# EAGLE design ow_switch2 (EAGLE 6.5.0)
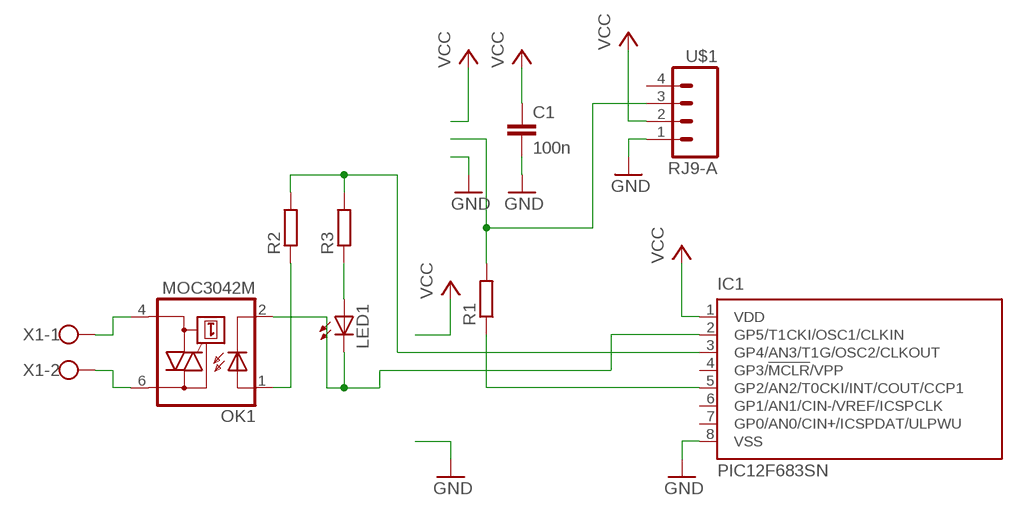
[diagram p0: schematic, sheet 1]

## Parts
C1  100n  C-EUC1206  [C1206]
IC1  PIC12F683SN  [SO-08]
LED1  LEDSMT1206  [1206]
OK1  MOC3042M  [DIL06]
R1  R-EU_R1206  [R1206]
R2  R-EU_R1206  [R1206]
R3  R-EU_R1206  [R1206]
U$1  RJ9-A  [RJ9-A]
X1  W237-102  [W237-102]

## Nets
GND: C1.2 IC1.8(VSS) U$1.1
N$1: LED1.A R3.1
N$2: IC1.5(GP2/AN2/T0CKI/INT/COUT/CCP1) R1.1
N$3: R1.2 U$1.3
N$4: IC1.3(GP4/AN3/T1G/OSC2/CLKOUT) R2.2 R3.2
N$5: OK1.1(A) R2.1
N$8: OK1.6(A2) X1.2
N$9: OK1.4(A1) X1.1
N$11: IC1.2(GP5/T1CKI/OSC1/CLKIN) LED1.C OK1.2(C)
VCC: C1.1 IC1.1(VDD) U$1.2
Unconnected: IC1.4(GP3/!MCLR!/VPP) IC1.6(GP1/AN1/CIN-/VREF/ICSPCLK) IC1.7(GP0/AN0/CIN+/ICSPDAT/ULPWU) U$1.4

## Library data of the parts
C1 = rcl:C-EU: CAPACITOR, European symbol
IC1 = microchip:PIC12F683: 8-Pin Flash-Based, 8-Bit CMOS Microcontrollers with nanoWatt Technology Source: http://ww1.microchip.com/downloads/en/DeviceDoc/41211D_.pdf; MF: MICROCHIP; MPN: PIC12F683-I/SN; OC_FARNELL: 9759042; OC_NEWARK: 61K3434
LED1 = led:LED: LED OSRAM: - CHIPLED LG R971, LG N971, LY N971, LG Q971, LY Q971, LO R971, LY R971 LH N974, LH R974 LS Q976, LO Q976, LY Q976 LO Q996 - Hyper CHIPLED LW Q18S LB Q993, LB Q99A, LB R99A - SideLED LS A670, LO A670, LY A670, LG A670, LP A670 LB A673, LV A673, LT A673, LW A673 LH A674 LY A675 LS A676, LA A676, LO A676, LY A676, LW A676 LS A679, LY A679, LG A679 - Hyper Micro SIDELED® LS Y876, LA Y876, LO Y876, LY Y876 LT Y87S - SmartLED LW L88C, LW L88S LB L89C, LB L89S, LG L890 LS L89K, LO L89K, LY L89K LS L896, LA L896, LO L896, LY L896 - TOPLED LS T670, LO T670, LY T670, LG T670, LP T670 LSG T670, LSP T670, LSY T670, LOP T670, LYG T670 LG T671, LOG T671, LSG T671 LB T673, LV T673, LT T673, LW T673 LH T674 LS T676, LA T676, LO T676, LY T676, LB T676, LH T676, LSB T676, LW T676 LB T67C, LV T67C, LT T67C, LS T67K, LO T67K, LY T67K, LW E67C LS E67B, LA E67B, LO E67B, LY E67B, LB E67C, LV E67C, LT E67C LW T67C LS T679, LY T679, LG T679 LS T770, LO T770, LY T770, LG T770, LP T770 LB T773, LV T773, LT T773, LW T773 LH T774 LS E675, LA E675, LY E675, LS T675 LS T776, LA T776, LO T776, LY T776, LB T776 LHGB T686 LT T68C, LB T68C - Hyper Mini TOPLED® LB M676 - Mini TOPLED Santana® LG M470 LS M47K, LO M47K, LY M47K Source: http://www.osram.convergy.de LUXEON: - LUMILED® LXK2-PW12-R00, LXK2-PW12-S00, LXK2-PW14-U00, LXK2-PW14-V00 LXK2-PM12-R00, LXK2-PM12-S00, LXK2-PM14-U00 LXK2-PE12-Q00, LXK2-PE12-R00, LXK2-PE12-S00, LXK2-PE14-T00, LXK2-PE14-U00 LXK2-PB12-K00, LXK2-PB12-L00, LXK2-PB12-M00, LXK2-PB14-N00, LXK2-PB14-P00, LXK2-PB14-Q00 LXK2-PR12-L00, LXK2-PR12-M00, LXK2-PR14-Q00, LXK2-PR14-R00 LXK2-PD12-Q00, LXK2-PD12-R00, LXK2-PD12-S00 LXK2-PH12-R00, LXK2-PH12-S00 LXK2-PL12-P00, LXK2-PL12-Q00, LXK2-PL12-R00 Source: www.luxeon.com KINGBRIGHT: KA-3528ASYC Source: www.kingbright.com
OK1 = optocoupler:MOC30*: 6-Pin DIP Zero-Cross Optoisolators Triac Driver Output (250/400 Volt Peak) Source: Data sheet <http://www.fairchildsemi.com/ds/MO/MOC3031M.pdf> The old path of data sheet not more available 2013-05-06.; MF: FAIRCHILD SEMICONDUCTOR; MPN: MOC3042-M; OC_FARNELL: 1021368; OC_NEWARK: 72K8899
R1-R3 = rcl:R-EU_: RESISTOR, European symbol
U$1 = SparkFun-Connectors:RJ9-A
X1 = con-wago-500:W237-102: WAGO SCREW CLAMP; MPN: 237-102; OC_FARNELL: unknown; OC_NEWARK: 70K9898

## Board
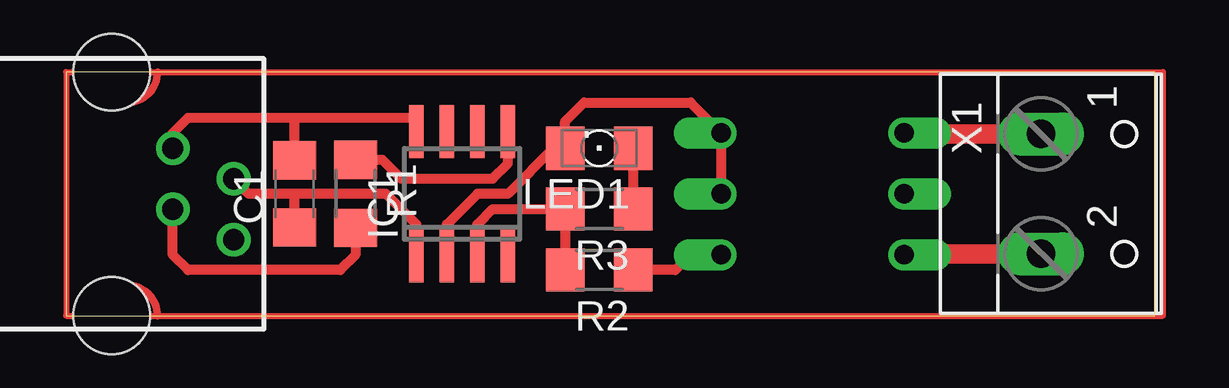
[diagram p1: board, top side]
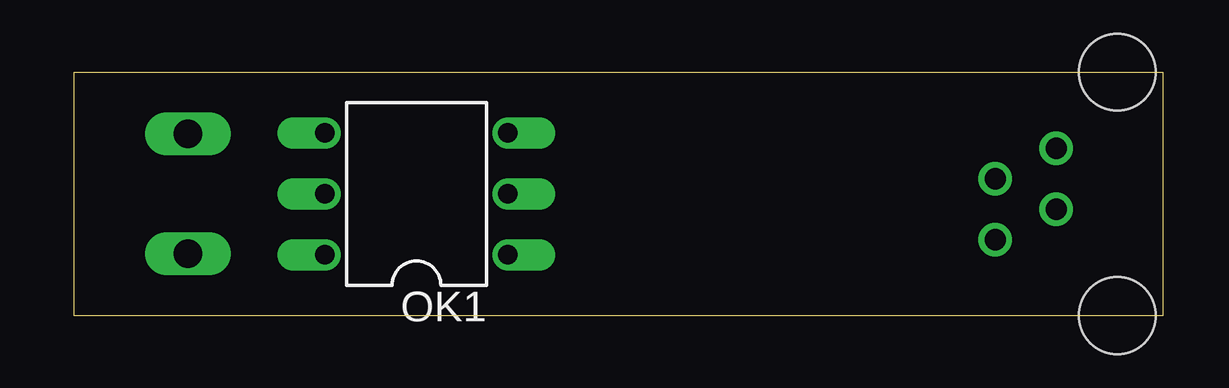
[diagram p2: board, bottom side, seen from below]

Size 45.39 x 10.15 mm. Coordinates in mm from the lower left corner, seen from the top.
Outline: 0,0 45.39,0 45.39,10.15 0,10.15 0,0
Copper layers (1*16): Top 0.035mm / dielectric 1.5mm / Bottom 0.035mm
Design rules "default": minimum track width 10mil, minimum drill 24mil, track to track 8mil, track to pad 8mil, pad to pad 8mil, via to via 8mil, smd to smd 8mil, copper to edge 40mil, drill to drill 8mil, minimum pad ring 10mil, minimum via ring 8mil, stop-mask expansion 4mil, vias tented up to drill 0mil, thermal gap 10mil

### Footprints (pad centres in the part's own frame; a part is rotated, then mirrored left to right if it is on the bottom)
C1206 = smd 1.6 x 1.8: 1 -1.4,0; 2 1.4,0
SO-08 = smd 0.6 x 2.2: 1 -1.905,-2.6; 2 -0.635,-2.6; 3 0.635,-2.6; 4 1.905,-2.6; 5 1.905,2.6; 6 0.635,2.6; 7 -0.635,2.6; 8 -1.905,2.6
1206 = smd 1.6 x 1.803: A -1.422,0; C 1.422,0
DIL06 = drill 0.813 offset: 1 -2.54,-3.81; 2 0,-3.81; 3 2.54,-3.81; 4 2.54,3.81; 5 0,3.81; 6 -2.54,3.81
R1206 = smd 1.6 x 1.803: 1 -1.422,0; 2 1.422,0
RJ9-A = drill 0.889: 1 -1.905,6.35; 2 -0.635,8.89; 3 0.635,6.35; 4 1.905,8.89 | hole 3.2: -5.08,3.81; 5.08,3.81
W237-102 = drill 1.194 long: 1 -2.5,-1.27; 2 2.5,-1.27

### Placement (x,y rotation side)
C1  9.53,5.08 90 top
IC1  16.51,5.08 0 top
LED1  22.23,6.99 180 top
OK1  31.11,5.08 90 bottom
R1  12.06,5.08 270 top
R2  22.23,1.91 180 top
R3  22.23,4.45 180 top
U$1  -1.91,5.08 270 top
X1  41.91,5.08 270 top

### Tracks (layer width: path | path; a pad name or v marks a point on that pad's centre or on a via)
GND
  Top 0.406: U$1.1 4.45,7.62 5.08,8.26 9.53,8.26 | 9.53,8.26 14.61,8.26 IC1.8 | C1.2 9.53,8.26
N$1
  Top 0.406: R3.1 LED1.A
N$2
  Top 0.406: R1.1 13.18,6.5 13.97,5.71 17.78,5.71 18.41,6.35 IC1.5
N$3
  Top 0.406: U$1.3 4.45,2.54 5.08,1.91 11.43,1.91 12.06,2.54 R1.2
N$4
  Top 0.406: 20.8,3.96 20.32,4.45 | IC1.3 17.14,3.81 17.78,4.45 R3.2 20.8,3.96 | 20.8,3.96 R2.2
N$5
  Top 0.406: OK1.1 26.04,2.54 25.4,1.91 R2.1
N$8
  Top 0.813: X1.2 34.97,2.58 OK1.6
N$9
  Top 0.813: X1.1 34.97,7.58 OK1.4
N$10  (via drill 0.6 pad 1.02)
  Top 0.254: 45.72,10.16 45.72,0 3.81,0 v2.54,0 1.27,0 0,0 0,10.16 1.27,10.16 v2.54,10.16 3.81,10.16 45.72,10.16
  Top 0.305: 1.27,0 arc-180 3.81,0 | 3.81,10.16 arc-180 1.27,10.16
N$11
  Top 0.406: IC1.2 15.88,3.81 17.14,5.08 18.41,5.08 20.32,6.99 LED1.C 20.8,8.1 21.59,8.89 26.04,8.89 27.3,7.62 OK1.2
VCC
  Top 0.406: IC1.1 14.61,3.81 13.34,5.08 9.53,5.08 | 9.53,5.08 7.62,5.08 U$1.2 | C1.1 9.53,5.08